# Altium schematic sheet MCU.SchDoc
size A4
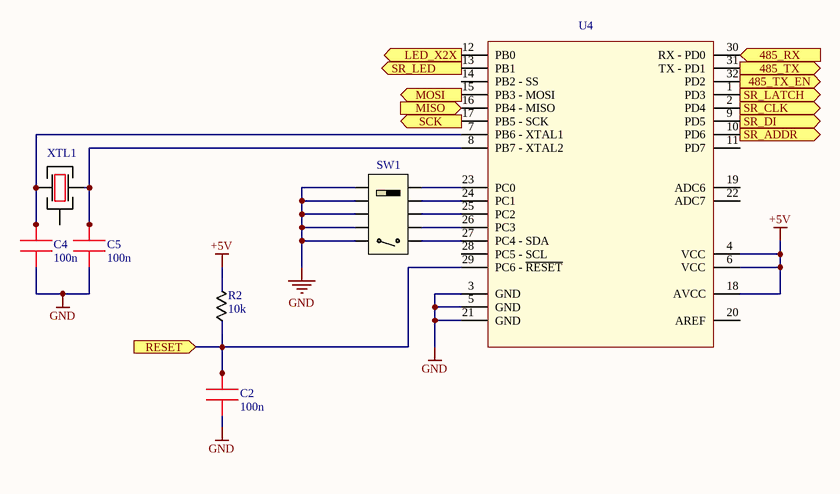
[diagram p0: MCU.SchDoc]

## Parts
C2  100n  [0603_CAP]
C4  100n  [0603_CAP]
C5  100n  [0603_CAP]
R2  10k  [0603_RES]
SW1  (no value)  [Switch DIP-5]
U4  (no value)  [TQFP-32]
XTL1  16.0 MHz  [KX-7 XTAL]  (value not drawn)

## Ports
485_RX, 485_TX, 485_TX_EN, LED_X2X, MISO, MOSI, RESET, SCK, SR_ADDR, SR_CLK, SR_DI, SR_LATCH, SR_LED

## Nets
+5V: R2.2 U4.4(VCC) U4.6(VCC) U4.18(AVCC)
GND: C2.1 C4.1 C5.1 SW1.1 SW1.3 SW1.5 SW1.7 SW1.9 U4.3(GND) U4.5(GND) U4.21(GND)
485_RX: U4.30(RX_-_PD0) ; port 485_RX
485_TX: U4.31(TX_-_PD1) ; port 485_TX
485_TX_EN: U4.32(PD2) ; port 485_TX_EN
LED_X2X: U4.12(PB0) ; port LED_X2X
MISO: U4.16(PB4_-_MISO) ; port MISO
MOSI: U4.15(PB3_-_MOSI) ; port MOSI
RESET: C2.2 R2.1 U4.29(PC6_-_~{RESET}) ; port RESET
SCK: U4.17(PB5_-_SCK) ; port SCK
SR_ADDR: U4.10(PD6) ; port SR_ADDR
SR_CLK: U4.2(PD4) ; port SR_CLK
SR_DI: U4.9(PD5) ; port SR_DI
SR_LATCH: U4.1(PD3) ; port SR_LATCH
SR_LED: U4.13(PB1) ; port SR_LED
NetC4_2: C4.2 U4.7(PB6_-_XTAL1) XTL1.1
NetC5_2: C5.2 U4.8(PB7_-_XTAL2) XTL1.3
NetSW1_2: SW1.2 U4.27(PC4_-_SDA)
NetSW1_4: SW1.4 U4.26(PC3)
NetSW1_6: SW1.6 U4.25(PC2)
NetSW1_8: SW1.8 U4.24(PC1)
NetSW1_10: SW1.10 U4.23(PC0)

Not connected (* = marked no-connect by the designer): U4 11(PD7) 14(PB2_-_SS) 19(ADC6) 20(AREF) 22(ADC7) 28(PC5_-_SCL); XTL1 2

## Library data of the parts
C2 C4 C5 = 0603 CAP: Part Description: Capacitor 0.1uF X7R 0603 10%; Part Number: CC0603KRX7R9BB104
R2 = Resistor 0805: Part Description: Resistor 0603, 10kOhms, 1%, 1/10W; Part Number: RC0603FR-0710KL
SW1 = Switch DIP-5: Part Description: Dip switch 5; Part Number: DPL-05-V (DS1040-05RT)
U4 = ATmega328: Part Description: MCU 8 bit; Part Number: ATmega328P-AU
XTL1 = KX-7: Part Description: Oscillator 16MHz; Part Number: Geyer KX-7T 16.0 MHz